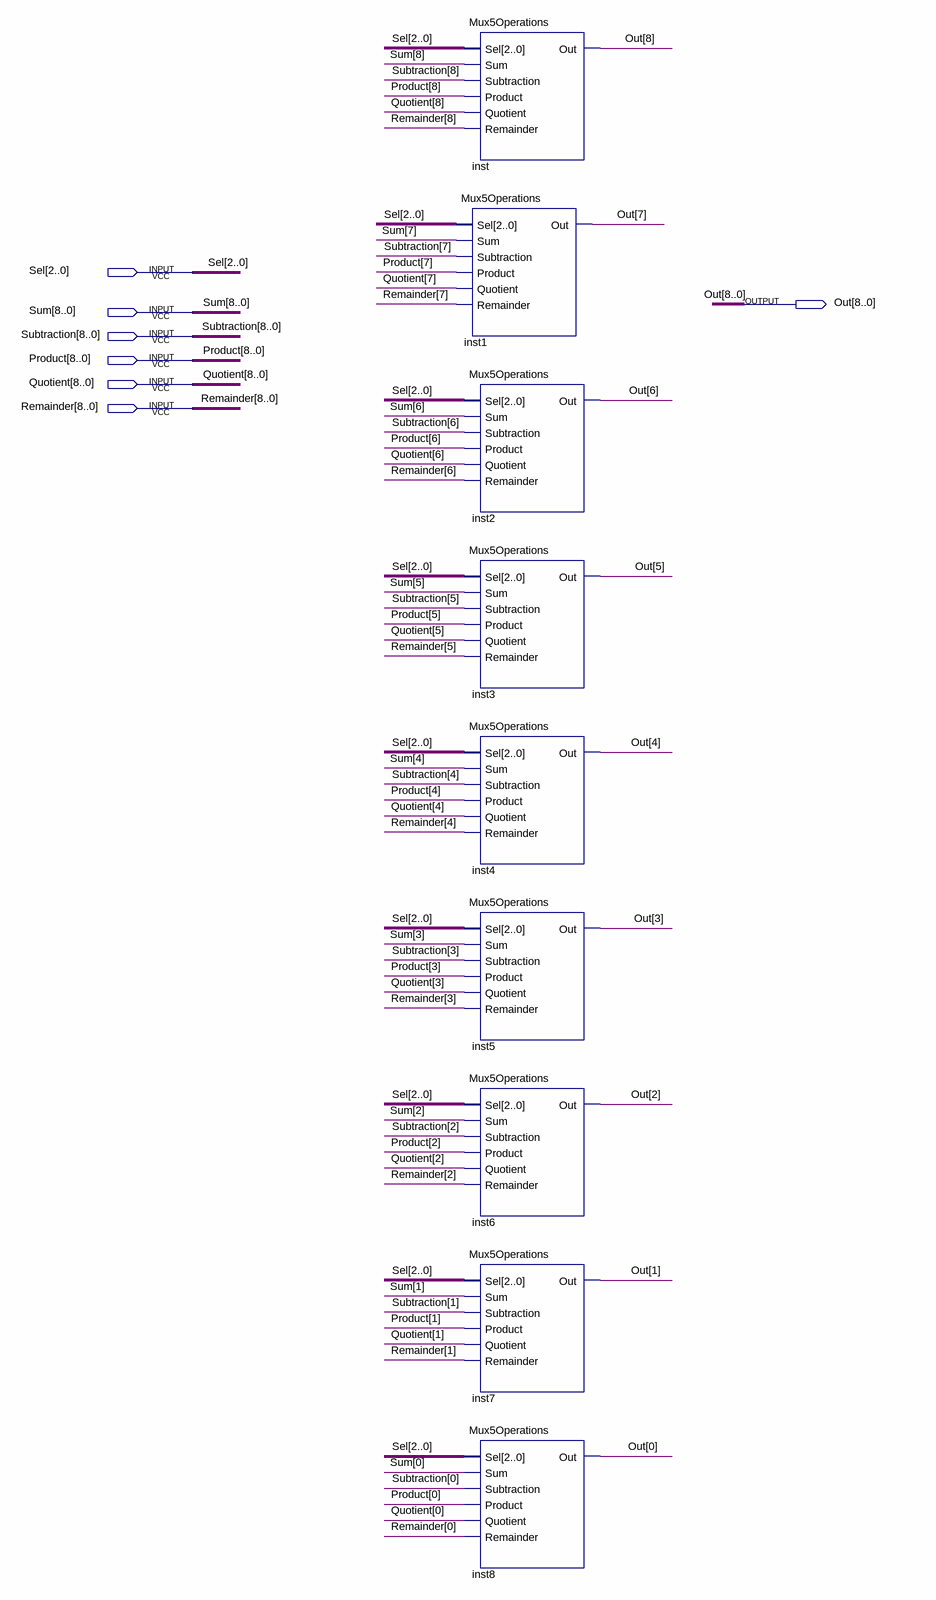
[diagram p0: schematic sheet]
// Quartus schematic BigMux.bdf as structural Verilog: 9 symbols, 7 pins
module BigMux (
  input  [2:0] Sel,
  input  [8:0] Sum,
  input  [8:0] Subtraction,
  input  [8:0] Product,
  input  [8:0] Quotient,
  input  [8:0] Remainder,
  output [8:0] Out
);

  Mux5Operations inst (
    .Sel(Sel), .Sum(Sum[8]), .Subtraction(Subtraction[8]), .Product(Product[8]), .Quotient(Quotient[8]),
    .Remainder(Remainder[8]), .Out(Out[8]));
  Mux5Operations inst1 (
    .Sel(Sel), .Sum(Sum[7]), .Subtraction(Subtraction[7]), .Product(Product[7]), .Quotient(Quotient[7]),
    .Remainder(Remainder[7]), .Out(Out[7]));
  Mux5Operations inst2 (
    .Sel(Sel), .Sum(Sum[6]), .Subtraction(Subtraction[6]), .Product(Product[6]), .Quotient(Quotient[6]),
    .Remainder(Remainder[6]), .Out(Out[6]));
  Mux5Operations inst3 (
    .Sel(Sel), .Sum(Sum[5]), .Subtraction(Subtraction[5]), .Product(Product[5]), .Quotient(Quotient[5]),
    .Remainder(Remainder[5]), .Out(Out[5]));
  Mux5Operations inst4 (
    .Sel(Sel), .Sum(Sum[4]), .Subtraction(Subtraction[4]), .Product(Product[4]), .Quotient(Quotient[4]),
    .Remainder(Remainder[4]), .Out(Out[4]));
  Mux5Operations inst5 (
    .Sel(Sel), .Sum(Sum[3]), .Subtraction(Subtraction[3]), .Product(Product[3]), .Quotient(Quotient[3]),
    .Remainder(Remainder[3]), .Out(Out[3]));
  Mux5Operations inst6 (
    .Sel(Sel), .Sum(Sum[2]), .Subtraction(Subtraction[2]), .Product(Product[2]), .Quotient(Quotient[2]),
    .Remainder(Remainder[2]), .Out(Out[2]));
  Mux5Operations inst7 (
    .Sel(Sel), .Sum(Sum[1]), .Subtraction(Subtraction[1]), .Product(Product[1]), .Quotient(Quotient[1]),
    .Remainder(Remainder[1]), .Out(Out[1]));
  Mux5Operations inst8 (
    .Sel(Sel), .Sum(Sum[0]), .Subtraction(Subtraction[0]), .Product(Product[0]), .Quotient(Quotient[0]),
    .Remainder(Remainder[0]), .Out(Out[0]));
endmodule
